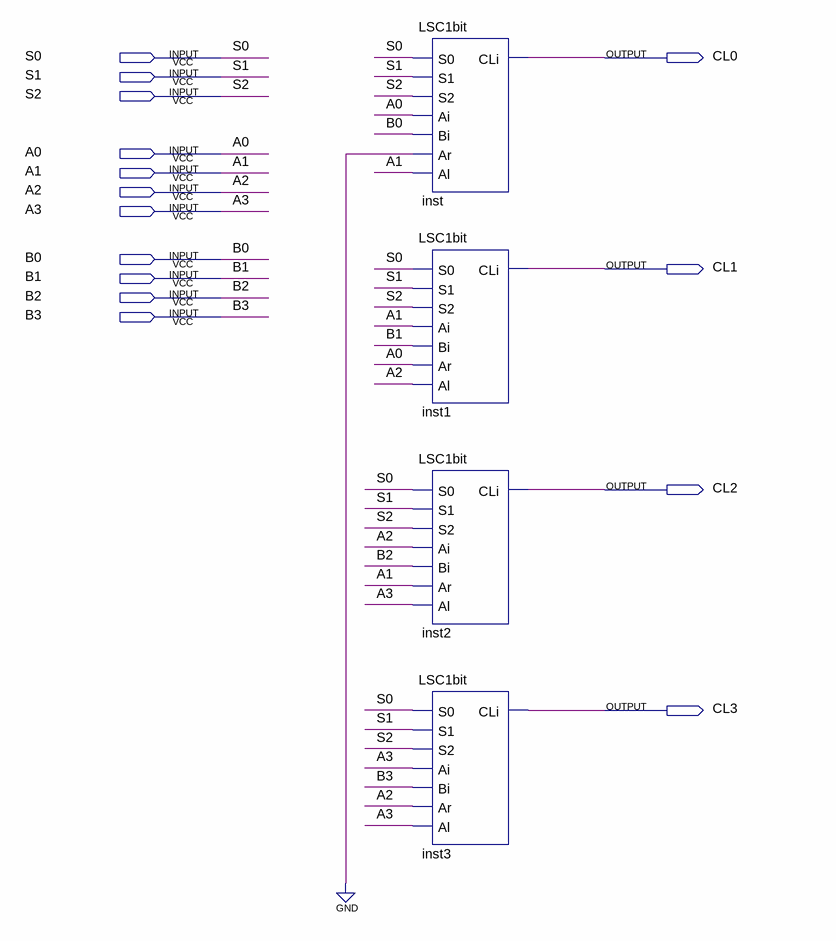
[diagram p0: schematic sheet]
// Quartus schematic LSC4bits.bdf as structural Verilog: 4 symbols, 15 pins
module LSC4bits (
  input  S0,
  input  S1,
  input  S2,
  input  A0,
  input  A1,
  input  A2,
  input  A3,
  input  B0,
  input  B1,
  input  B2,
  input  B3,
  output CL0,
  output CL1,
  output CL2,
  output CL3
);

  LSC1bit inst (.S0(S0), .S1(S1), .S2(S2), .Ai(A0), .Bi(B0), .Ar(1'b0), .Al(A1), .CLi(CL0));
  LSC1bit inst1 (.S0(S0), .S1(S1), .S2(S2), .Ai(A1), .Bi(B1), .Ar(A0), .Al(A2), .CLi(CL1));
  LSC1bit inst2 (.S0(S0), .S1(S1), .S2(S2), .Ai(A2), .Bi(B2), .Ar(A1), .Al(A3), .CLi(CL2));
  LSC1bit inst3 (.S0(S0), .S1(S1), .S2(S2), .Ai(A3), .Bi(B3), .Ar(A2), .Al(A3), .CLi(CL3));
endmodule
